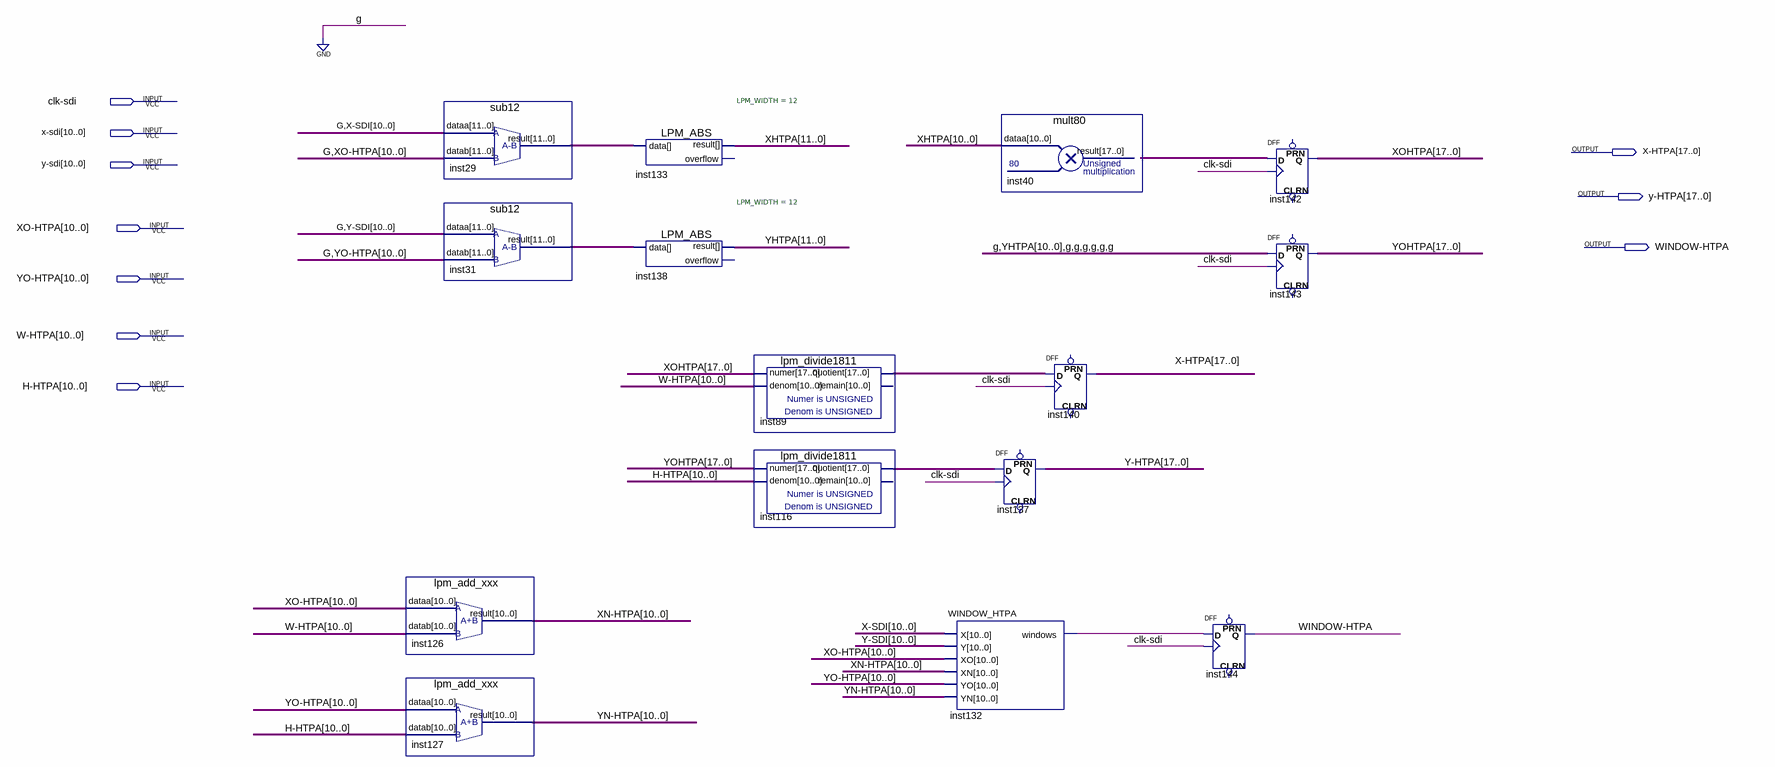
[diagram p0: schematic sheet]
// Quartus schematic HTPA_coords.bdf as structural Verilog: 15 symbols, 10 pins
module HTPA_coords (
  input  \clk-sdi ,
  input  [10:0] \x-sdi ,
  input  [10:0] \y-sdi ,
  input  [10:0] \XO-HTPA ,
  input  [10:0] \YO-HTPA ,
  input  [10:0] \W-HTPA ,
  input  [10:0] \H-HTPA ,
  output [17:0] \X-HTPA ,
  output [17:0] \y-HTPA ,
  output \WINDOW-HTPA 
);

  wire inst132_windows;
  wire [10:0] \XN-HTPA , \YN-HTPA ;
  wire [11:0] inst29_result, inst31_result, XHTPA, YHTPA;
  wire [17:0] inst40_result, inst89_quotient, inst116_quotient, XOHTPA, YOHTPA;

  sub12 inst29 (.dataa({1'b0, \x-sdi }), .datab({1'b0, \XO-HTPA }), .result(inst29_result));
  sub12 inst31 (.dataa({1'b0, \y-sdi }), .datab({1'b0, \YO-HTPA }), .result(inst31_result));
  lpm_add_xxx inst126 (.dataa(\XO-HTPA ), .datab(\W-HTPA ), .result(\XN-HTPA ));
  lpm_add_xxx inst127 (.dataa(\YO-HTPA ), .datab(\H-HTPA ), .result(\YN-HTPA ));
  LPM_ABS #(.LPM_WIDTH(12)) inst133 (.data(inst29_result), .result(XHTPA));  // open: overflow
  LPM_ABS #(.LPM_WIDTH(12)) inst138 (.data(inst31_result), .result(YHTPA));  // open: overflow
  lpm_divide1811 inst89 (.numer(XOHTPA), .denom(\W-HTPA ), .quotient(inst89_quotient));  // open: remain
  lpm_divide1811 inst116 (.numer(YOHTPA), .denom(\H-HTPA ), .quotient(inst116_quotient));  // open: remain
  WINDOW_HTPA inst132 (
    .X(\x-sdi ), .Y(\y-sdi ), .XO(\XO-HTPA ), .XN(\XN-HTPA ), .YO(\YO-HTPA ), .YN(\YN-HTPA ),
    .windows(inst132_windows));
  mult80 inst40 (.dataa(XHTPA[10:0]), .result(inst40_result));
  DFF inst137[17:0] (.CLK(\clk-sdi ), .D(inst116_quotient), .Q(\y-HTPA ));  // open: CLRN, PRN
  DFF inst140[17:0] (.CLK(\clk-sdi ), .D(inst89_quotient), .Q(\X-HTPA ));  // open: CLRN, PRN
  DFF inst144 (.CLK(\clk-sdi ), .D(inst132_windows), .Q(\WINDOW-HTPA ));  // open: CLRN, PRN
  DFF inst142[17:0] (.CLK(\clk-sdi ), .D(inst40_result), .Q(XOHTPA));  // open: CLRN, PRN
  DFF inst143[17:0] (.CLK(\clk-sdi ), .D({1'b0, YHTPA[10:0], {6{1'b0}}}), .Q(YOHTPA));  // open: CLRN, PRN
endmodule
